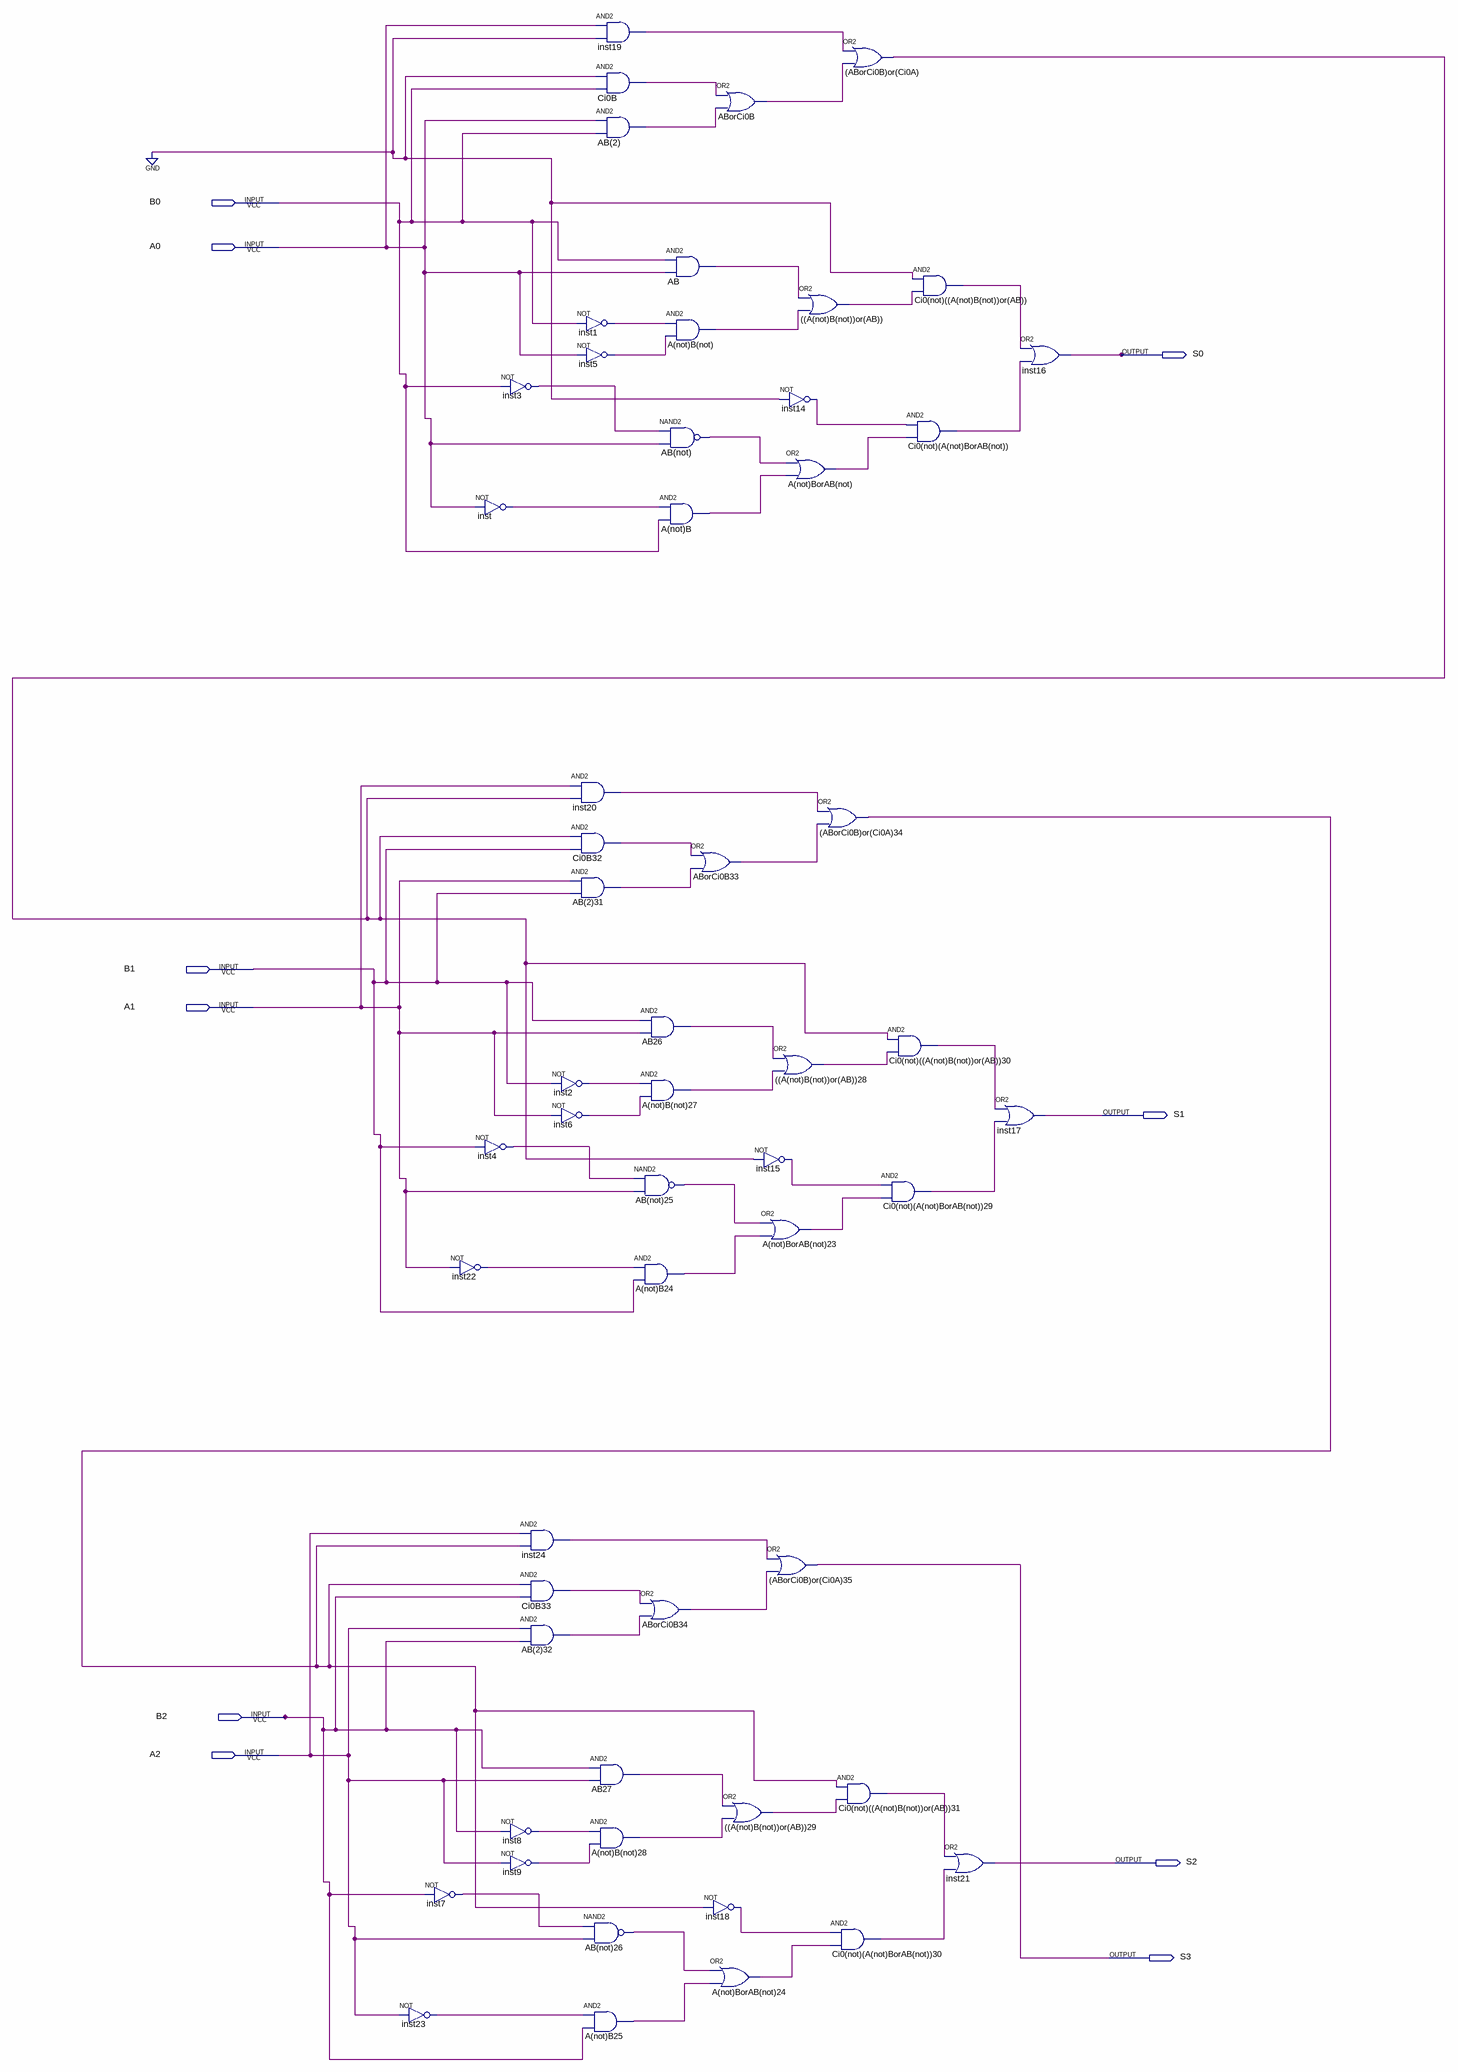
[diagram p0: schematic sheet]
// Quartus schematic ThreeBitAdder.bdf as structural Verilog: 57 symbols, 10 pins
module ThreeBitAdder (
  input  B0,
  input  A0,
  input  B1,
  input  A1,
  input  B2,
  input  A2,
  output S0,
  output S1,
  output S2,
  output S3
);

  wire __A_not_B_not__or_AB__28_out, __A_not_B_not__or_AB__29_out, __A_not_B_not__or_AB___out,
       _ABorCi0B_or_Ci0A_34_out, _ABorCi0B_or_Ci0A__out, A_not_B24_out, A_not_B25_out, A_not_B_not_27_out,
       A_not_B_not_28_out, A_not_B_not__out, A_not_B_out, A_not_BorAB_not_23_out, A_not_BorAB_not_24_out,
       A_not_BorAB_not__out, AB26_out, AB27_out, AB_2_31_out, AB_2_32_out, AB_2__out, AB_not_25_out,
       AB_not_26_out, AB_not__out, AB_out, ABorCi0B33_out, ABorCi0B34_out, ABorCi0B_out,
       Ci0_not___A_not_B_not__or_AB__30_out, Ci0_not___A_not_B_not__or_AB__31_out,
       Ci0_not___A_not_B_not__or_AB___out, Ci0_not__A_not_BorAB_not__29_out,
       Ci0_not__A_not_BorAB_not__30_out, Ci0_not__A_not_BorAB_not___out, Ci0B32_out, Ci0B33_out, Ci0B_out,
       inst1_out, inst2_out, inst3_out, inst4_out, inst5_out, inst6_out, inst7_out, inst8_out, inst9_out,
       inst14_out, inst15_out, inst18_out, inst19_out, inst20_out, inst22_out, inst23_out, inst24_out,
       inst_out;

  not inst23 (inst23_out, A2);
  not inst22 (inst22_out, A1);
  not inst7 (inst7_out, B2);
  not inst3 (inst3_out, B0);
  not inst (inst_out, A0);
  not inst4 (inst4_out, B1);
  not inst8 (inst8_out, B2);
  not inst9 (inst9_out, A2);
  not inst2 (inst2_out, B1);
  not inst6 (inst6_out, A1);
  and inst24 (inst24_out, A2, _ABorCi0B_or_Ci0A_34_out);
  and Ci0B33 (Ci0B33_out, _ABorCi0B_or_Ci0A_34_out, B2);
  and \AB(2)32  (AB_2_32_out, A2, B2);
  and inst19 (inst19_out, A0, 1'b0);
  and Ci0B (Ci0B_out, 1'b0, B0);
  and \AB(2)  (AB_2__out, A0, B0);
  not inst1 (inst1_out, B0);
  not inst5 (inst5_out, A0);
  and inst20 (inst20_out, A1, _ABorCi0B_or_Ci0A__out);
  and Ci0B32 (Ci0B32_out, _ABorCi0B_or_Ci0A__out, B1);
  and \AB(2)31  (AB_2_31_out, A1, B1);
  and AB27 (AB27_out, B2, A2);
  and \A(not)B(not)28  (A_not_B_not_28_out, inst8_out, inst9_out);
  nand \AB(not)26  (AB_not_26_out, inst7_out, A2);
  and \A(not)B25  (A_not_B25_out, inst23_out, B2);
  and AB26 (AB26_out, B1, A1);
  and \A(not)B(not)27  (A_not_B_not_27_out, inst2_out, inst6_out);
  nand \AB(not)25  (AB_not_25_out, inst4_out, A1);
  and \A(not)B24  (A_not_B24_out, inst22_out, B1);
  or ABorCi0B34 (ABorCi0B34_out, Ci0B33_out, AB_2_32_out);
  and AB (AB_out, B0, A0);
  and \A(not)B(not)  (A_not_B_not__out, inst1_out, inst5_out);
  nand \AB(not)  (AB_not__out, inst3_out, A0);
  and \A(not)B  (A_not_B_out, inst_out, B0);
  or ABorCi0B33 (ABorCi0B33_out, Ci0B32_out, AB_2_31_out);
  not inst18 (inst18_out, _ABorCi0B_or_Ci0A_34_out);
  or ABorCi0B (ABorCi0B_out, Ci0B_out, AB_2__out);
  not inst15 (inst15_out, _ABorCi0B_or_Ci0A__out);
  or \u_((A(not)B(not))or(AB))29  (__A_not_B_not__or_AB__29_out, AB27_out, A_not_B_not_28_out);
  or \A(not)BorAB(not)24  (A_not_BorAB_not_24_out, AB_not_26_out, A_not_B25_out);
  or \u_((A(not)B(not))or(AB))  (__A_not_B_not__or_AB___out, AB_out, A_not_B_not__out);
  not inst14 (inst14_out, 1'b0);
  or \A(not)BorAB(not)  (A_not_BorAB_not__out, AB_not__out, A_not_B_out);
  or \u_((A(not)B(not))or(AB))28  (__A_not_B_not__or_AB__28_out, AB26_out, A_not_B_not_27_out);
  or \A(not)BorAB(not)23  (A_not_BorAB_not_23_out, AB_not_25_out, A_not_B24_out);
  or \u_(ABorCi0B)or(Ci0A)35  (S3, inst24_out, ABorCi0B34_out);
  or \u_(ABorCi0B)or(Ci0A)  (_ABorCi0B_or_Ci0A__out, inst19_out, ABorCi0B_out);
  or \u_(ABorCi0B)or(Ci0A)34  (_ABorCi0B_or_Ci0A_34_out, inst20_out, ABorCi0B33_out);
  and \Ci0(not)((A(not)B(not))or(AB))31  (Ci0_not___A_not_B_not__or_AB__31_out, _ABorCi0B_or_Ci0A_34_out, __A_not_B_not__or_AB__29_out);
  and \Ci0(not)(A(not)BorAB(not))30  (Ci0_not__A_not_BorAB_not__30_out, inst18_out, A_not_BorAB_not_24_out);
  and \Ci0(not)(A(not)BorAB(not))  (Ci0_not__A_not_BorAB_not___out, inst14_out, A_not_BorAB_not__out);
  and \Ci0(not)((A(not)B(not))or(AB))30  (Ci0_not___A_not_B_not__or_AB__30_out, _ABorCi0B_or_Ci0A__out, __A_not_B_not__or_AB__28_out);
  and \Ci0(not)(A(not)BorAB(not))29  (Ci0_not__A_not_BorAB_not__29_out, inst15_out, A_not_BorAB_not_23_out);
  and \Ci0(not)((A(not)B(not))or(AB))  (Ci0_not___A_not_B_not__or_AB___out, 1'b0, __A_not_B_not__or_AB___out);
  or inst21 (S2, Ci0_not___A_not_B_not__or_AB__31_out, Ci0_not__A_not_BorAB_not__30_out);
  or inst17 (S1, Ci0_not___A_not_B_not__or_AB__30_out, Ci0_not__A_not_BorAB_not__29_out);
  or inst16 (S0, Ci0_not___A_not_B_not__or_AB___out, Ci0_not__A_not_BorAB_not___out);
endmodule
